# Altium schematic sheet Sheet1.SchDoc
size A
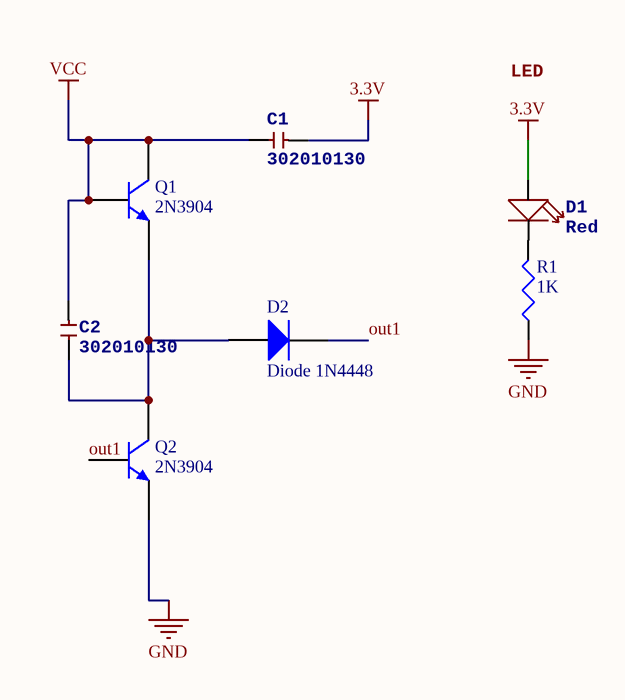
[diagram p0: Sheet1.SchDoc]

## Parts
C1  302010130  [C0603]
C2  302010130  [C0603]
D1  Red  [LED-0603]
D2  Diode 1N4448  [DO-35]
Q1  2N3904  [TO-92A]
Q2  2N3904  [TO-92A]
R1  value 1K  [J1-0603]  (hidden comment: Res3)

## Nets
3.3V: C1.2 D1.+
GND: Q2.1(E) R1.1
VCC: C1.1 C2.2 Q1.2(B) Q1.3(C)
out1: D2.2(K) Q2.2(B)
NetC2_1: C2.1 D2.1(A) Q1.1(E) Q2.3(C)
NetD1_-: D1.- R1.2

## Notes on the sheet
- LED

## Library data of the parts
C1 C2 = CERAMIC-470PF-100V-5%-NP0(0603): MPN: GRM1885C2A471JA01D
D1 = LED-0603
D2 = Diode 1N4448: High Conductance Fast Diode; Published: 8-Jun-2000; LatestRevisionDate: 17-Jul-2002; LatestRevisionNote: Re-released for DXP Platform.; DatasheetVersion: 1997; PackageReference: DO-35; Publisher: Altium Limited; PackageDescription: Diode, Axial; Body 3.8 x 1.9 mm (LxDia. max), Lead Dia. 0.53 mm (max); Code_JEDEC: DO-204-AH; ComponentLink1Description: Manufacturer Link; ComponentLink1URL: http://www.fairchildsemi.com/; ComponentLink2Description: Datasheet; ComponentLink2URL: http://www.fairchildsemi.com/ds/1N%2F1N4448.pdf
Q1 Q2 = 2N3904: NPN General Purpose Amplifier; Published: 8-Jun-2000; LatestRevisionDate: 15-Jan-2003; LatestRevisionNote: PCB Footprint 'BCY-W3/D4.7' replaced; DatasheetVersion: 1997; PackageVersion: Sep-1998; PackageReference: TO-92A; Publisher: Altium Limited; PackageDescription: TO, Flat Index; 3 In-Line, Axial Leads; Body Dia. 4.5mm; Leads 0.51 x 0.48 mm (max); ComponentLink1Description: Manufacturer Link; ComponentLink1URL: http://www.fairchildsemi.com/; ComponentLink2Description: Datasheet; ComponentLink2URL: http://www.fairchildsemi.com/ds/2N%2F2N3904.pdf
R1 = Res3: Resistor; Published: 8-Jun-2000; LatestRevisionDate: 29-May-2009; LatestRevisionNote: IPC-7351 Footprint Added.; PackageReference: J1-0603; Publisher: Altium Limited; PackageDescription: Chip Resistor